# Altium schematic sheet Camera.SchDoc
size A3; DocumentNumber: 8; SheetNumber: 8; SheetTotal: 10; PageSetup: Record=PageOptions|CenterHorizontal=True|CenterVertical=True|PrintScale=0.97|XCorrection=1.00|YCorrection=1.00|PrintKind=1|BorderSize=5000000|LeftOffset=0|BottomOffset=0|Orientation=2|PaperLength=2970|PaperWidth=2100|Scale=100|PaperSource=7|PrintQuality=600|MediaType=1|DitherType=10|PaperKind=A4|PrintScaleMode=1
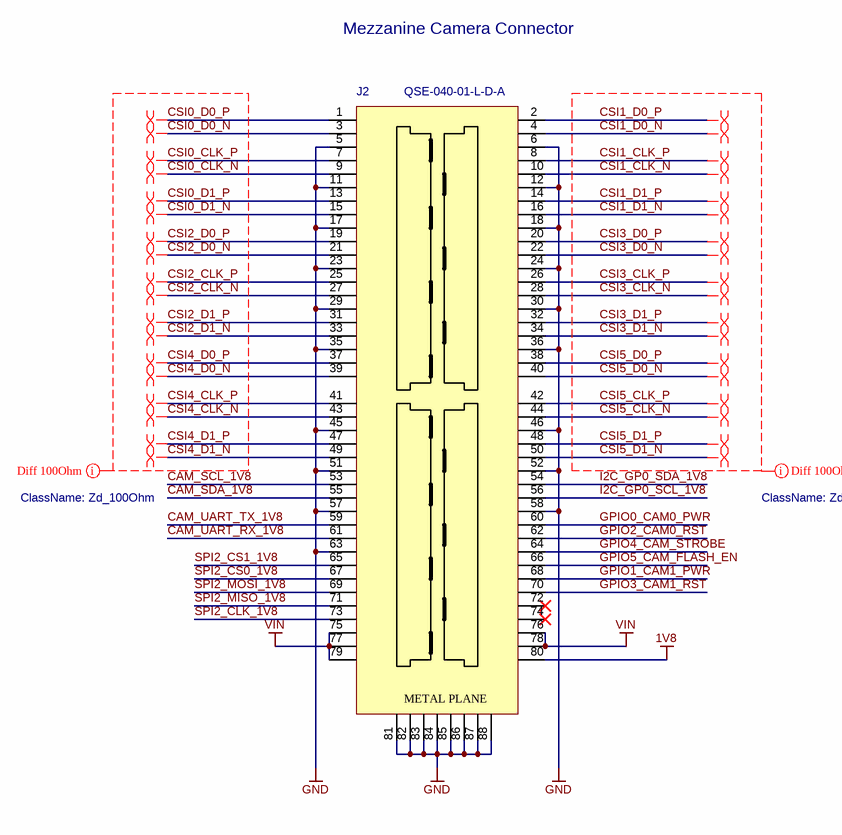
[diagram p0: Camera.SchDoc]

## Parts
J2  QSE-040-01-L-D-A  [QSE-040-01-L-D-A]

## Nets
1V8: J2.80
GND: J2.5 J2.6 J2.11 J2.12 J2.17 J2.18 J2.23 J2.24 J2.29 J2.30 J2.35 J2.36 J2.45 J2.46 J2.51 J2.52 J2.57 J2.58 J2.63 J2.81 J2.82 J2.83 J2.84 J2.85 J2.86 J2.87 J2.88
VIN: J2.75 J2.76 J2.77 J2.78 J2.79
CAM_SCL_1V8: J2.53
CAM_SDA_1V8: J2.55
CAM_UART_RX_1V8: J2.61
CAM_UART_TX_1V8: J2.59
CSI0_CLK_N: J2.9
CSI0_CLK_P: J2.7
CSI0_D0_N: J2.3
CSI0_D0_P: J2.1
CSI0_D1_N: J2.15
CSI0_D1_P: J2.13
CSI1_CLK_N: J2.10
CSI1_CLK_P: J2.8
CSI1_D0_N: J2.4
CSI1_D0_P: J2.2
CSI1_D1_N: J2.16
CSI1_D1_P: J2.14
CSI2_CLK_N: J2.27
CSI2_CLK_P: J2.25
CSI2_D0_N: J2.21
CSI2_D0_P: J2.19
CSI2_D1_N: J2.33
CSI2_D1_P: J2.31
CSI3_CLK_N: J2.28
CSI3_CLK_P: J2.26
CSI3_D0_N: J2.22
CSI3_D0_P: J2.20
CSI3_D1_N: J2.34
CSI3_D1_P: J2.32
CSI4_CLK_N: J2.43
CSI4_CLK_P: J2.41
CSI4_D0_N: J2.39
CSI4_D0_P: J2.37
CSI4_D1_N: J2.49
CSI4_D1_P: J2.47
CSI5_CLK_N: J2.44
CSI5_CLK_P: J2.42
CSI5_D0_N: J2.40
CSI5_D0_P: J2.38
CSI5_D1_N: J2.50
CSI5_D1_P: J2.48
GPIO0_CAM0_PWR: J2.60
GPIO1_CAM1_PWR: J2.68
GPIO2_CAM0_RST: J2.62
GPIO3_CAM1_RST: J2.70
GPIO4_CAM_STROBE: J2.64
GPIO5_CAM_FLASH_EN: J2.66
I2C_GP0_SCL_1V8: J2.56
I2C_GP0_SDA_1V8: J2.54
SPI2_CLK_1V8: J2.73
SPI2_CS0_1V8: J2.67
SPI2_CS1_1V8: J2.65
SPI2_MISO_1V8: J2.71
SPI2_MOSI_1V8: J2.69

Not connected (* = marked no-connect by the designer): J2 72* 74*

## Layout directives
differential pair: CSI0_CLK_N, CSI0_CLK_P, CSI0_D0_N, CSI0_D0_P, CSI0_D1_N, CSI0_D1_P, CSI1_CLK_N, CSI1_CLK_P, CSI1_D0_N, CSI1_D0_P, CSI1_D1_N, CSI1_D1_P, CSI2_CLK_N, CSI2_CLK_P, CSI2_D0_N, CSI2_D0_P, CSI2_D1_N, CSI2_D1_P, CSI3_CLK_N, CSI3_CLK_P, CSI3_D0_N, CSI3_D0_P, CSI3_D1_N, CSI3_D1_P, CSI4_CLK_N, CSI4_CLK_P, CSI4_D0_N, CSI4_D0_P, CSI4_D1_N, CSI4_D1_P, CSI5_CLK_N, CSI5_CLK_P, CSI5_D0_N, CSI5_D0_P, CSI5_D1_N, CSI5_D1_P
net class Zd_100Ohm: CSI0_CLK_N, CSI0_CLK_P, CSI0_D0_N, CSI0_D0_P, CSI0_D1_N, CSI0_D1_P, CSI1_CLK_N, CSI1_CLK_P, CSI1_D0_N, CSI1_D0_P, CSI1_D1_N, CSI1_D1_P, CSI2_CLK_N, CSI2_CLK_P, CSI2_D0_N, CSI2_D0_P, CSI2_D1_N, CSI2_D1_P, CSI3_CLK_N, CSI3_CLK_P, CSI3_D0_N, CSI3_D0_P, CSI3_D1_N, CSI3_D1_P, CSI4_CLK_N, CSI4_CLK_P, CSI4_D0_N, CSI4_D0_P, CSI4_D1_N, CSI4_D1_P, CSI5_CLK_N, CSI5_CLK_P, CSI5_D0_N, CSI5_D0_P, CSI5_D1_N, CSI5_D1_P

## Notes on the sheet
- Mezzanine Camera Connector
- Title:
- Size:
- Date:
- A3
- Revision:
- Page:
- of
- Antmicro Ltd.
- File:
- www.antmicro.com
- (in symbol QSE-040-01-L-D-A) METAL PLANE

## Library data of the parts
J2 = QSE-040-01-L-D-A: SAMTEC 	QSE-040-01-L-D-A  Stacking Board Connector, Dual Row, QSE Series, Receptacle, 0.8 mm, 80 Contacts, Surface Mount; Part Number: QSE-040-01-L-D-A; Value: QSE-040-01-L-D-A; Manufacturer: SAMTEC; Part Symbol: QSE-040-01-L-D-A